# Altium schematic sheet MCU.SchDoc
size A; SheetNumber: 1; SheetTotal: 5
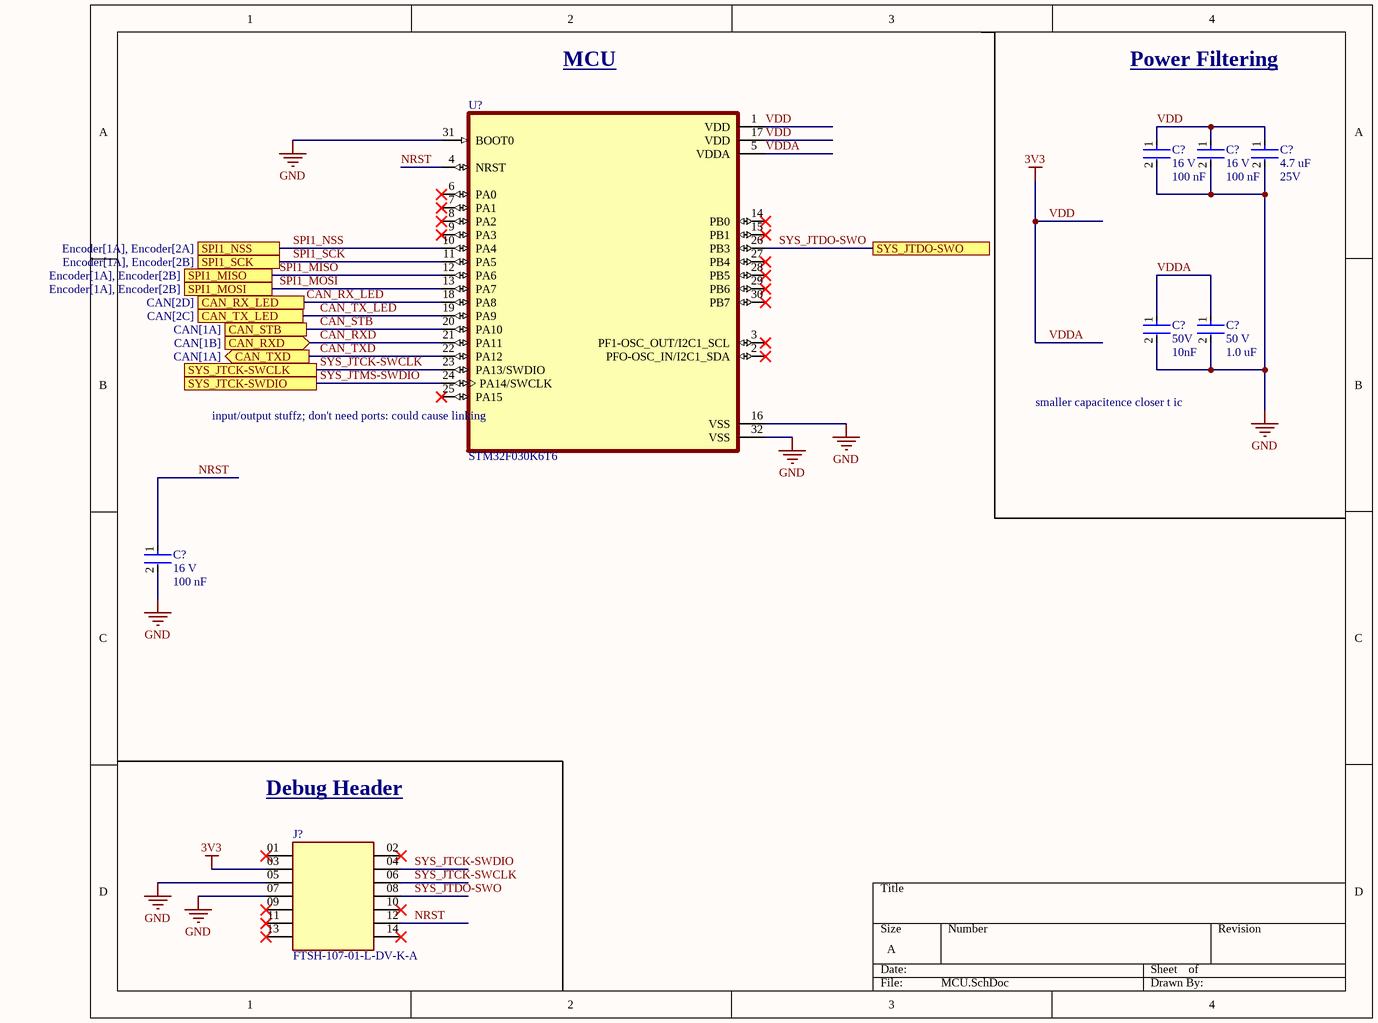
[diagram p0: MCU.SchDoc]

## Parts
(Parts that share a designator on the sheet are numbered #1, #2 ... from top to bottom, then left to right.)
C?#1  Voltage Rating: 16 V  Capacitance: 100 nF  [CAP-0402]  (hidden comment: CC0402KRX7R7BB104)
C?#2  Voltage Rating: 16 V  Capacitance: 100 nF  [CAP-0402]  (hidden comment: CC0402KRX7R7BB104)
C?#3  Capacitance: 4.7 uF  Voltage: 25V  [CAP-0603]  (hidden comment: CC0603KRX5R8BB475)
C?#4  Voltage: 50V  Capacitance: 10nF  [CAP-0805]  (hidden comment: GRM2195C1H103JA01D)
C?#5  Voltage: 50 V  Capacitance: 1.0 uF  [CAP-0805]  (hidden comment: CC0805KKX7R9BB105)
C?#6  Voltage Rating: 16 V  Capacitance: 100 nF  [CAP-0402]  (hidden comment: CC0402KRX7R7BB104)
J?  FTSH-107-01-L-DV-K-A  [CONN-14POS-0001]
U?  STM32F030K6T6  [QFP80P900X900X160-32N]

## Ports
CAN_RX_LED (see CAN[2D]), CAN_RXD (in, see CAN[1B]), CAN_STB (see CAN[1A]), CAN_TX_LED (see CAN[2C]), CAN_TXD (out, see CAN[1A]), SPI1_MISO (see Encoder[1A], Encoder[2B]), SPI1_MOSI (see Encoder[1A], Encoder[2B]), SPI1_NSS (see Encoder[1A], Encoder[2A]), SPI1_SCK (see Encoder[1A], Encoder[2B]), SYS_JTCK-SWCLK, SYS_JTCK-SWDIO, SYS_JTDO-SWO

## Nets
GND: C?#1.2 C?#2.2 C?#3.2 C?#4.2 C?#5.2 C?#6.2 J?.05 J?.07 U?.16(VSS) U?.31(BOOT0) U?.32(VSS)
VDD: C?#1.1 C?#2.1 C?#3.1 C?#4.1 C?#5.1 J?.03 U?.1(VDD) U?.5(VDDA) U?.17(VDD)  [also labelled 3V3, VDDA]
CAN_RX_LED: U?.18(PA8) ; port CAN_RX_LED
CAN_RXD: U?.21(PA11) ; port CAN_RXD
CAN_STB: U?.20(PA10) ; port CAN_STB
CAN_TX_LED: U?.19(PA9) ; port CAN_TX_LED
CAN_TXD: U?.22(PA12) ; port CAN_TXD
NRST: C?#6.1 J?.12 U?.4(NRST)
SPI1_MISO: U?.12(PA6) ; port SPI1_MISO
SPI1_MOSI: U?.13(PA7) ; port SPI1_MOSI
SPI1_NSS: U?.10(PA4) ; port SPI1_NSS
SPI1_SCK: U?.11(PA5) ; port SPI1_SCK
SYS_JTCK-SWCLK: J?.06 U?.23(PA13/SWDIO) ; port SYS_JTCK-SWCLK
SYS_JTCK-SWDIO: J?.04
SYS_JTDO-SWO: J?.08 U?.26(PB3) ; port SYS_JTDO-SWO
SYS_JTMS-SWDIO: U?.24(PA14/SWCLK) ; port SYS_JTCK-SWDIO

Not connected (* = marked no-connect by the designer): J? 01* 02* 09* 10* 11* 13* 14*; U? 2(PFO-OSC_IN/I2C1_SDA)* 3(PF1-OSC_OUT/I2C1_SCL)* 6(PA0)* 7(PA1)* 8(PA2)* 9(PA3)* 14(PB0)* 15(PB1)* 25(PA15)* 27(PB4)* 28(PB5)* 29(PB6)* 30(PB7)*

## Notes on the sheet
- MCU
- Power Filtering
- (near U?) input/output stuffz; don't need ports: could cause linking
- smaller capacitence closer t ic
- Debug Header

## Library data of the parts
C?#1 C?#2 C?#6 = CAP-0.1U-0001: CAP CER 0.1UF 16V X7R 0402; ComponentLink2Description: Datasheet; ComponentLink2URL: https://www.yageo.com/upload/media/product/productsearch/datasheet/mlcc/UPY-GPHC_X7R_6.3V-to-250V_24.pdf; Device Class: Ceramic; Size: 0402
C?#3 = CAP-4.7U-0001: CAP CER 4.7UF 25V X5R 0603; Device Class: Ceramic; Size: 0603
C?#4 = CAP-10N-0001: CAP CER 10000PF 50V C0G/NP0 0805; Device Class: Ceramic; Size: 0805; ComponentLink1Description: Datasheet; ComponentLink1URL: https://search.murata.co.jp/Ceramy/image/img/A01X/G101/ENG/GRM2195C1H103JA01-01.pdf
C?#5 = CAP-1U-0001: CAP CER 1UF 50V X7R 0805; ComponentLink2URL: https://www.yageo.com/upload/media/product/productsearch/datasheet/mlcc/UPY-GPHC_X7R_6.3V-to-250V_24.pdf; ComponentLink2Description: Datasheet; Device Class: Ceramic; Size: 0805
J? = CONN-14POS-0001_1: Connector Header Surface Mount 14 position 0.050 (1.27mm); MF: Samtec Inc.; SnapEDA_Link: https://www.snapeda.com/parts/FTSH-107-01-L-DV-K-A/Samtec+Inc./view-part/?ref=snap; Package: None; Value: *; MP: FTSH-107-01-L-DV-K-A; Check_prices: https://www.snapeda.com/parts/FTSH-107-01-L-DV-K-A/Samtec+Inc./view-part/?ref=eda
U? = IC-STM 32 BIT 32 KB 32 LQFP: ARMÂ® CortexÂ®-M0 STM32F0 Microcontroller IC 32-Bit Single-Core 48MHz 32KB (32K x 8) FLASH 32-LQFP (7x7); MF: STMicroelectronics; Check_prices: https://www.snapeda.com/parts/STM32F030K6T6/STMicroelectronics/view-part/?ref=eda; Digi-Key_Part_Number: 497-14046-ND; Package: LQFP-32 STMicroelectronics; MP: STM32F030K6T6; Value: *; SnapEDA_Link: https://www.snapeda.com/parts/STM32F030K6T6/STMicroelectronics/view-part/?ref=snap; Purchase-URL: https://pricing.snapeda.com/search/part/STM32F030K6T6/?ref=eda